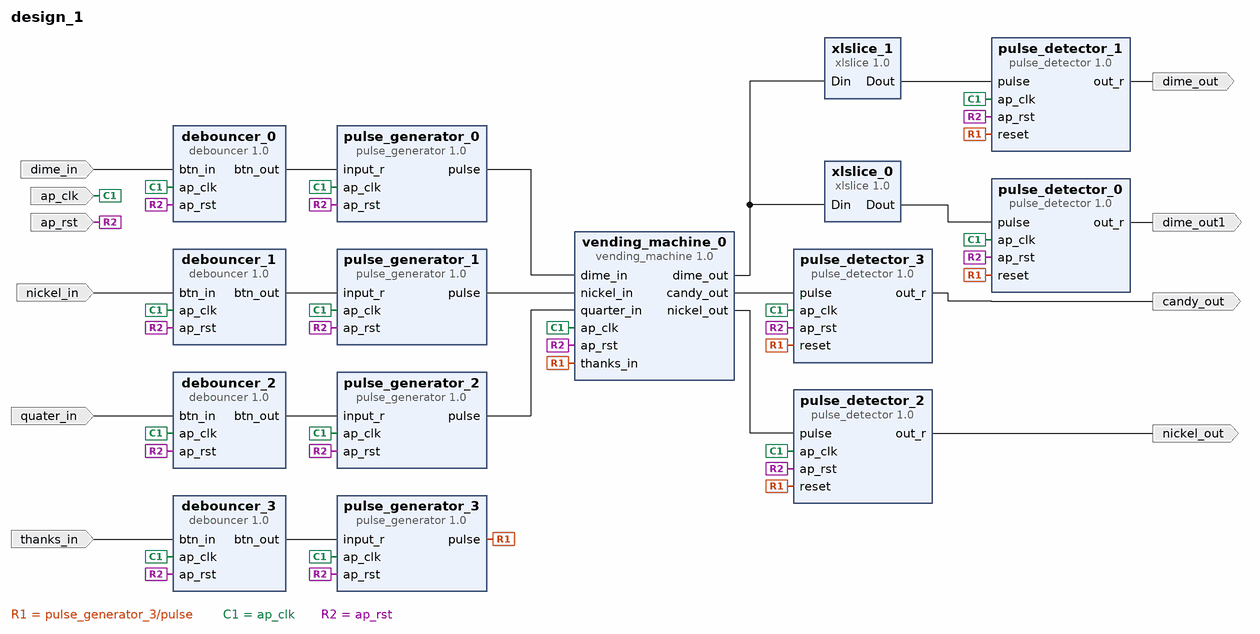
[diagram p0: block diagram of the top level]
# Vivado block design design_1, xc7z020clg484-1, Vivado 2023.1
create_bd_design design_1

create_bd_port -dir I nickel_in
create_bd_port -dir I quater_in
create_bd_port -dir I thanks_in
create_bd_port -dir O dime_out
create_bd_port -dir O dime_out1
create_bd_port -dir I dime_in
create_bd_port -dir I ap_clk
create_bd_port -dir I ap_rst
create_bd_port -dir O candy_out
create_bd_port -dir O nickel_out

create_bd_cell -type ip -vlnv xilinx.com:hls:pulse_generator:1.0 pulse_generator_0
create_bd_cell -type ip -vlnv xilinx.com:hls:pulse_generator:1.0 pulse_generator_1
create_bd_cell -type ip -vlnv xilinx.com:hls:pulse_generator:1.0 pulse_generator_2
create_bd_cell -type ip -vlnv xilinx.com:hls:pulse_generator:1.0 pulse_generator_3
create_bd_cell -type ip -vlnv xilinx.com:hls:pulse_detector:1.0 pulse_detector_0
create_bd_cell -type ip -vlnv xilinx.com:hls:pulse_detector:1.0 pulse_detector_1
create_bd_cell -type ip -vlnv xilinx.com:hls:pulse_detector:1.0 pulse_detector_2
create_bd_cell -type ip -vlnv xilinx.com:hls:pulse_detector:1.0 pulse_detector_3
create_bd_cell -type ip -vlnv xilinx.com:ip:xlslice:1.0 xlslice_0
set_property -dict {CONFIG.DIN_FROM 1 CONFIG.DIN_TO 1 CONFIG.DIN_WIDTH 2 CONFIG.DOUT_WIDTH 2} [get_bd_cells xlslice_0]
create_bd_cell -type ip -vlnv xilinx.com:ip:xlslice:1.0 xlslice_1
set_property -dict {CONFIG.DIN_FROM 1 CONFIG.DIN_TO 1 CONFIG.DIN_WIDTH 2 CONFIG.DOUT_WIDTH 2} [get_bd_cells xlslice_1]
create_bd_cell -type ip -vlnv xilinx.com:hls:debouncer:1.0 debouncer_0
create_bd_cell -type ip -vlnv xilinx.com:hls:debouncer:1.0 debouncer_1
create_bd_cell -type ip -vlnv xilinx.com:hls:debouncer:1.0 debouncer_2
create_bd_cell -type ip -vlnv xilinx.com:hls:debouncer:1.0 debouncer_3
create_bd_cell -type ip -vlnv xilinx.com:hls:vending_machine:1.0 vending_machine_0

# ---- connections ----

connect_bd_net [get_bd_pins pulse_generator_3/pulse] \
  [get_bd_pins pulse_detector_1/reset] [get_bd_pins pulse_detector_3/reset] [get_bd_pins pulse_detector_0/reset] \
  [get_bd_pins pulse_detector_2/reset] [get_bd_pins vending_machine_0/thanks_in]
connect_bd_net [get_bd_ports ap_clk] \
  [get_bd_pins pulse_generator_1/ap_clk] [get_bd_pins pulse_generator_2/ap_clk] [get_bd_pins pulse_generator_3/ap_clk] \
  [get_bd_pins pulse_generator_0/ap_clk] [get_bd_pins pulse_detector_1/ap_clk] [get_bd_pins pulse_detector_0/ap_clk] \
  [get_bd_pins pulse_detector_3/ap_clk] [get_bd_pins pulse_detector_2/ap_clk] [get_bd_pins debouncer_0/ap_clk] \
  [get_bd_pins debouncer_1/ap_clk] [get_bd_pins debouncer_2/ap_clk] [get_bd_pins debouncer_3/ap_clk] \
  [get_bd_pins vending_machine_0/ap_clk]
connect_bd_net [get_bd_ports ap_rst] \
  [get_bd_pins pulse_generator_3/ap_rst] [get_bd_pins pulse_generator_1/ap_rst] [get_bd_pins pulse_generator_0/ap_rst] \
  [get_bd_pins pulse_generator_2/ap_rst] [get_bd_pins pulse_detector_1/ap_rst] [get_bd_pins pulse_detector_0/ap_rst] \
  [get_bd_pins pulse_detector_3/ap_rst] [get_bd_pins pulse_detector_2/ap_rst] [get_bd_pins debouncer_0/ap_rst] \
  [get_bd_pins debouncer_1/ap_rst] [get_bd_pins debouncer_2/ap_rst] [get_bd_pins debouncer_3/ap_rst] \
  [get_bd_pins vending_machine_0/ap_rst]
connect_bd_net [get_bd_pins debouncer_0/btn_out] [get_bd_pins pulse_generator_0/input_r]
connect_bd_net [get_bd_pins debouncer_1/btn_out] [get_bd_pins pulse_generator_1/input_r]
connect_bd_net [get_bd_pins debouncer_2/btn_out] [get_bd_pins pulse_generator_2/input_r]
connect_bd_net [get_bd_pins debouncer_3/btn_out] [get_bd_pins pulse_generator_3/input_r]
connect_bd_net [get_bd_ports dime_in] [get_bd_pins debouncer_0/btn_in]
connect_bd_net [get_bd_ports nickel_in] [get_bd_pins debouncer_1/btn_in]
connect_bd_net [get_bd_pins pulse_detector_0/out_r] [get_bd_ports dime_out1]
connect_bd_net [get_bd_pins pulse_detector_1/out_r] [get_bd_ports dime_out]
connect_bd_net [get_bd_pins pulse_detector_2/out_r] [get_bd_ports nickel_out]
connect_bd_net [get_bd_pins pulse_detector_3/out_r] [get_bd_ports candy_out]
connect_bd_net [get_bd_pins pulse_generator_0/pulse] [get_bd_pins vending_machine_0/dime_in]
connect_bd_net [get_bd_pins pulse_generator_1/pulse] [get_bd_pins vending_machine_0/nickel_in]
connect_bd_net [get_bd_pins pulse_generator_2/pulse] [get_bd_pins vending_machine_0/quarter_in]
connect_bd_net [get_bd_ports quater_in] [get_bd_pins debouncer_2/btn_in]
connect_bd_net [get_bd_ports thanks_in] [get_bd_pins debouncer_3/btn_in]
connect_bd_net [get_bd_pins vending_machine_0/candy_out] [get_bd_pins pulse_detector_3/pulse]
connect_bd_net [get_bd_pins vending_machine_0/dime_out] [get_bd_pins xlslice_0/Din] [get_bd_pins xlslice_1/Din]
connect_bd_net [get_bd_pins vending_machine_0/nickel_out] [get_bd_pins pulse_detector_2/pulse]
connect_bd_net [get_bd_pins xlslice_0/Dout] [get_bd_pins pulse_detector_0/pulse]
connect_bd_net [get_bd_pins xlslice_1/Dout] [get_bd_pins pulse_detector_1/pulse]

validate_bd_design
save_bd_design
